# EAGLE design ATM90E26_Featherwing (EAGLE 7.5.0)
CNAME: ATM90E26 ENERGY MINION FEATHERWING; CREVISION: 1.2; DESIGNER: Gokul Shrinivas
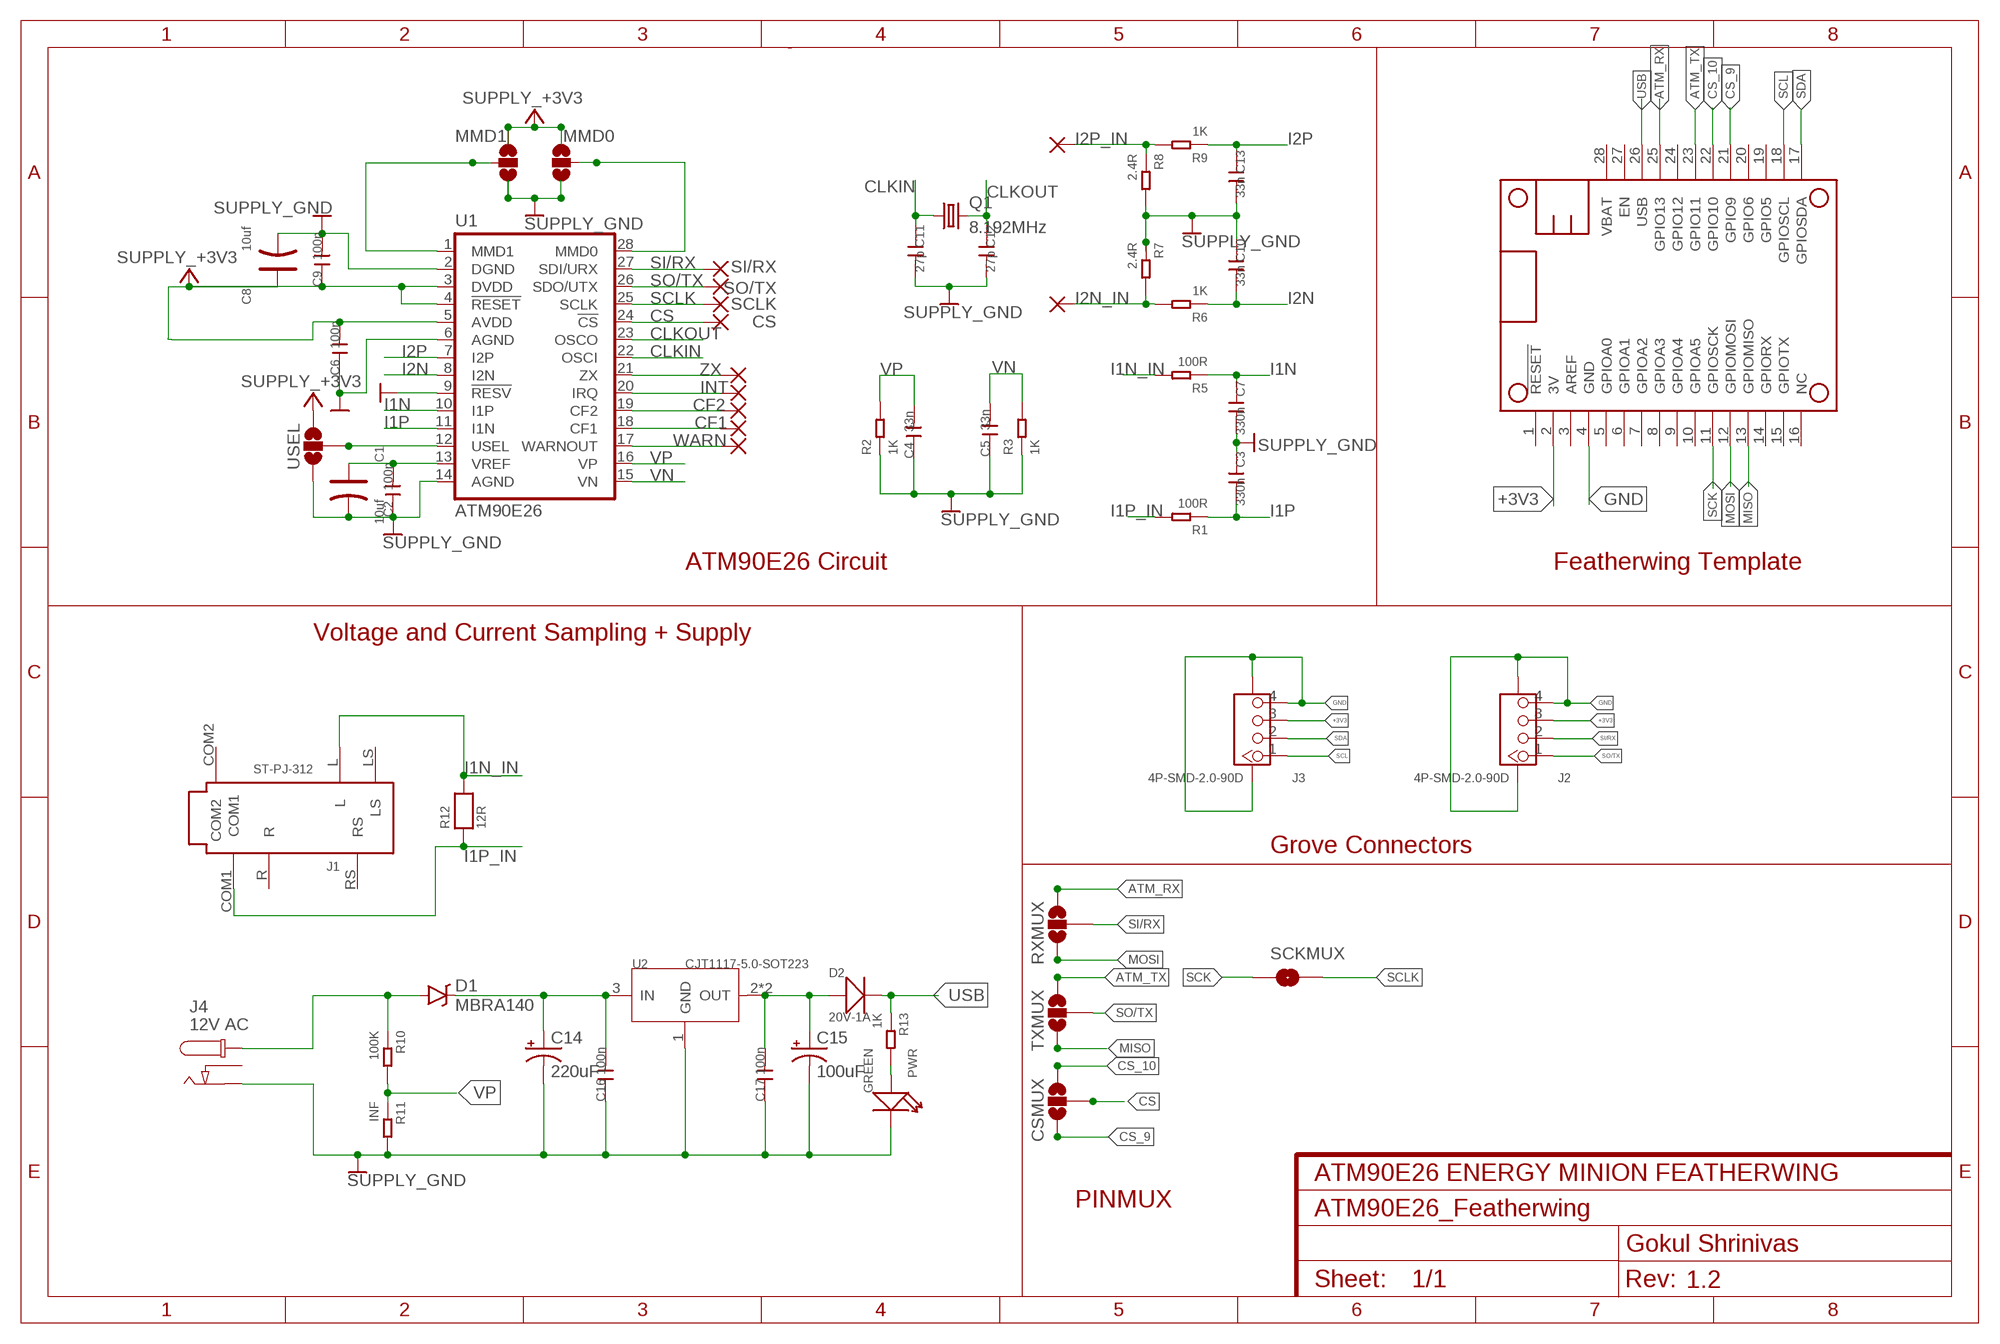
[diagram p0: schematic, sheet 1]

## Parts
C1  10uf  TANTALUM-SMD-22UF-10V(AVX-A)  [AVX-A]
C2  100n  C-0603  [C0603]
C3  330n  C-0603  [C0603]
C4  33n  C-0603  [C0603]
C5  33n  C-0603  [C0603]
C6  100n  C-0603  [C0603]
C7  330n  C-0603  [C0603]
C8  10uf  TANTALUM-SMD-22UF-10V(AVX-A)  [AVX-A]
C9  100n  C-0603  [C0603]
C10  33n  C-0603  [C0603]
C11  27p  C-0603  [C0603]
C12  27p  C-0603  [C0603]
C13  33n  C-0603  [C0603]
C14  220uF  CPOL-US140CLH-1010  [140CLH-1010]
C15  100uF  CPOL-US153CLV-0605  [153CLV-0605]
C16  100n  C-0603  [C0603]
C17  100n  C-0603  [C0603]
CF1  WIREPADSMD1,27-254  [SMD1,27-2,54]
CF2  WIREPADSMD1,27-254  [SMD1,27-2,54]
CS  WIREPADSMD1,27-254  [SMD1,27-2,54]
CSMUX  JUMPER-PAD-3-NOYES_SILK  [PAD-JUMPER-3-NO_YES_SILK]
D1  MBRA140  [SMA-DIODE]
D2  20V-1A  SMD-DIODE-SCHOTTKY-20V-1A(SOD-123)  [SOD-123]
I2N_IN  WIREPADSMD1,27-254  [SMD1,27-2,54]
I2P_IN  WIREPADSMD1,27-254  [SMD1,27-2,54]
INT  WIREPADSMD1,27-254  [SMD1,27-2,54]
J1  ST-PJ-312  AUDIO-JACK-6P-SMD(ST-PJ-312)  [AUDIO6P-SMD-3.5-14.0X6.4X5.0MM]
J2  4P-SMD-2.0-90D  GROVE-CONNECTOR-SMD-90D(4+2P-2.0)  [HW4-SMD-2.0-90D]
J3  4P-SMD-2.0-90D  GROVE-CONNECTOR-SMD-90D(4+2P-2.0)  [HW4-SMD-2.0-90D]
J4  12V AC  CON_DC_M-DC_SMD  [DC_BARREL_JACK_SMD_2MM]
MMD0  JUMPER-PAD-3-NOFULL_BOX_SILK  [PAD-JUMPER-3-NO_YES_SILK_FULL_BOX]
MMD1  JUMPER-PAD-3-NOFULL_BOX_SILK  [PAD-JUMPER-3-NO_YES_SILK_FULL_BOX]
MS1  FEATHERWING_NODIM  [FEATHERWING_DIM]
PWR  GREEN  LED'0603'  [LED-0603]
Q1  8.192MHz  CRYSTALHC49UP  [HC49UP]
R1  100R  SMD-RES-1K(0603)  [R0603]
R2  1K  SMD-RES-1K(0603)  [R0603]
R3  1K  SMD-RES-1K(0603)  [R0603]
R5  100R  SMD-RES-1K(0603)  [R0603]
R6  1K  SMD-RES-1K(0603)  [R0603]
R7  2.4R  SMD-RES-1K(0603)  [R0603]
R8  2.4R  SMD-RES-1K(0603)  [R0603]
R9  1K  SMD-RES-1K(0603)  [R0603]
R10  100K  SMD-RES-0R(0603)  [R0603]
R11  INF  SMD-RES-0R(0603)  [R0603]
R12  12R  RESISTOR0805  [0805]
R13  1K  SMD-RES-0R(0603)  [R0603]
RXMUX  JUMPER-PAD-3-NOYES_SILK  [PAD-JUMPER-3-NO_YES_SILK]
SCKMUX  JUMPER-PAD-2-NOYES_SILK  [PAD-JUMPER-2-NO_YES_SILK]
SCLK  WIREPADSMD1,27-254  [SMD1,27-2,54]
SI/RX  WIREPADSMD1,27-254  [SMD1,27-2,54]
SO/TX  WIREPADSMD1,27-254  [SMD1,27-2,54]
TXMUX  JUMPER-PAD-3-NOYES_SILK  [PAD-JUMPER-3-NO_YES_SILK]
U1  ATM90E26  [SSOP-28]
U2  CJT1117-5.0-SOT223  PMIC-CJT1117-5.0(SOT223)  [SOT-223]
USEL  JUMPER-PAD-3-NOFULL_BOX_SILK  [PAD-JUMPER-3-NO_YES_SILK_FULL_BOX]
WARN  WIREPADSMD1,27-254  [SMD1,27-2,54]
ZX  WIREPADSMD1,27-254  [SMD1,27-2,54]

## Nets
+3V3 [pwr]: C6.2 C8.+ C9.1 J2.3 J3.3 MMD0.3 MMD1.1 MS1.2(3V) U1.3(DVDD) U1.4(!RESET) U1.5(AVDD) USEL.3 ; supply symbol labelled SUPPLY_+3V3
ATM_RX: MS1.25(GPIO13) RXMUX.3
ATM_TX: MS1.23(GPIO11) TXMUX.3
CLKIN: C11.1 Q1.1 U1.22(OSCI)
CLKOUT: C12.1 Q1.2 U1.23(OSCO)
CS: CS.1(P) CSMUX.2 U1.24(!CS)
CS_9: CSMUX.1 MS1.21(GPIO9)
CS_10: CSMUX.3 MS1.22(GPIO10)
GND [pwr]: C1.- C2.1 C3.1 C4.1 C5.1 C6.1 C7.2 C8.- C9.2 C10.1 C11.2 C12.2 C13.2 C14.- C15.- C16.1 C17.1 J2.4 J2.SS1 J2.SS2 J3.4 J3.SS1 J3.SS2 J4.P2 MMD0.1 MMD1.3 MS1.4(GND) PWR.- R2.1 R3.1 R7.1 R8.2 R11.2 U1.2(DGND) U1.6(AGND) U1.9(!RESV) U1.14(AGND) U2.1(GND) USEL.1 ; supply symbol labelled SUPPLY_GND
I1N: C7.1 R5.1 U1.10(I1P)
I1N_IN: J1.L R5.2 R12.2
I1P: C3.2 R1.1 U1.11(I1N)
I1P_IN: J1.COM1 R1.2 R12.1
I2N: C10.2 R6.1 U1.8(I2N)
I2N_IN: I2N_IN.1(P) R6.2 R7.2
I2P: C13.1 R9.1 U1.7(I2P)
I2P_IN: I2P_IN.1(P) R8.1 R9.2
MISO: MS1.13(GPIOMISO) TXMUX.1
MOSI: MS1.12(GPIOMOSI) RXMUX.1
N$1: MMD1.2 U1.1(MMD1)
N$2: MMD0.2 U1.28(MMD0)
N$3 [pwr]: D1.A J4.P1@2(P1) R10.1
N$4: C14.+ C16.2 D1.C U2.3(IN)
N$8: PWR.+ R13.2
N$11: CF1.1(P) U1.18(CF1)
N$12: CF2.1(P) U1.19(CF2)
N$15: U1.12(USEL) USEL.2
N$20: U1.21(ZX) ZX.1(P)
N$21: INT.1(P) U1.20(IRQ)
N$22: U1.17(WARNOUT) WARN.1(P)
SCK: MS1.11(GPIOSCK) SCKMUX.1
SCL: J3.1 MS1.18(GPIOSCL)
SCLK: SCKMUX.2 SCLK.1(P) U1.25(SCLK)
SDA: J3.2 MS1.17(GPIOSDA)
SI/RX: J2.2 RXMUX.2 SI/RX.1(P) U1.27(SDI/URX)
SO/TX: J2.1 SO/TX.1(P) TXMUX.2 U1.26(SDO/UTX)
USB [pwr]: D2.- MS1.26(USB) R13.1
V_OUT [pwr]: C15.+ C17.2 D2.+ U2.2(OUT) U2.TER(OUT)
VN: C5.2 R3.2 U1.15(VN)
VP: C4.2 R2.2 R10.2 R11.1 U1.16(VP)
VREF: C1.+ C2.2 U1.13(VREF)
Unconnected: J1.COM2 J1.LS J1.R J1.RS J4.P3 MS1.1(!RESET) MS1.3(AREF) MS1.5(GPIOA0) MS1.6(GPIOA1) MS1.7(GPIOA2) MS1.8(GPIOA3) MS1.9(GPIOA4) MS1.10(GPIOA5) MS1.14(GPIORX) MS1.15(GPIOTX) MS1.16(NC) MS1.19(GPIO5) MS1.20(GPIO6) MS1.24(GPIO12) MS1.27(EN) MS1.28(VBAT)

## Notes on the sheet
- ATM90E26 Circuit | Featherwing Template
- Voltage and Current Sampling + Supply
- Grove Connectors
- PINMUX

## Library data of the parts
C1 C8 = Seeed-Capacitor-2016:TANTALUM-SMD-22UF-10V(AVX-A): 302020008; MPN: TAJA226*010#NJ; VALUE: 22uf
C2-C7 C9-C13 C16 C17 = Discrete:C*: Ceramic Capacitors
C14 C15 = adafruit:CPOL-US: POLARIZED CAPACITOR, American symbol
CF1 CF2 CS I2N_IN I2P_IN INT SCLK SI/RX SO/TX WARN ZX = wirepad:WIREPAD: Wire PAD connect wire on PCB
CSMUX MMD0 MMD1 RXMUX TXMUX USEL = SparkFun-Passives:JUMPER-PAD-3-NO
D1 = SparkFun-DiscreteSemi:MBRA140: 40V, 1A Schottky rectifier SMA/DO-214AC package DIO-08053; PROD_ID: DIO-08053
D2 = Seeed-OPL-Diode:SMD-DIODE-SCHOTTKY-20V-1A(SOD-123): 304020034; MPN: B5819W
J1 = Seeed-OPL-Connector:AUDIO-JACK-6P-SMD(ST-PJ-312): 320040007
J2 J3 = Seeed-Connector -2016:GROVE-CONNECTOR-SMD-90D(4+2P-2.0): 320110032
J4 = dp_devices:CON_DC_M: DC power connector
MS1 = adafruit:FEATHERWING
PWR = Discrete-new:LED
Q1 = crystal:CRYSTAL: CRYSTAL; OC_FARNELL: unknown; OC_NEWARK: unknown
R1 R5 R7 R8 = Seeed-Resistor-2016:SMD-RES-1K(0603): 301010298; MPN: RC0603FR-071KL; VALUE: 1K
R2 R3 R6 R9 = Seeed-Resistor-2016:SMD-RES-1K(0603): 301010298; MPN: RC0603FR-071KL
R10 R11 R13 = Seeed-Resistor-2016:SMD-RES-0R(0603): 301010292; MPN: RC0603JR-070RL; VALUE: 0R
R12 = microbuilder:RESISTOR: Resistors 0402 - 0402 Surface Mount Package 22 Ohm 1% 1/16W [Digikey: 311-22.0LRTR-ND] 33 Ohm 5% 1/16W 1.0K 5% 1/16W 1.5K 5% 1/16W 2.0K 1% 1/16W 10.0K 1% 1/16W [Digikey: 311-10.0KLRTR-ND] 10.0K 5% 1/16W [Digikey: RMCF0402JT10K0TR-ND] 12.1K 1% 1/16W [Digikey: 311-22.0LRTR-ND] 100.0K 5% 1/16W 0603 - 0603 Surface Mount Package 0 Ohm 1/10 Watt 1% Resistor 15 Ohm 1/10 Watt 1% Resistor 33 Ohm 1/10 Watt 1% Resistor 49.9 Ohm 1/10 Watt 1% Resistor 100 Ohm 1/10 Watt 1% Resistor 150 Ohm 1/10 Watt 1% Resistor 240 Ohm 1/10 Watt 1% Resistor 390 Ohm 1/10 Watt 1% Resistor 560 Ohm 1/10 Watt 1% Resistor 680 Ohm 1/10 Watt 1% Resistor 750 Ohm 1/10 Watt 1% Resistor 1.0K Ohm 1/10 Watt 1% Resistor 1.5K Ohm 1/10 Watt 1% Resistor 2.0K Ohm 1/10 Watt 1% Resistor 2.2K Ohm 1/10 Watt 1% Resistor 3.3K Ohm 1/10 Watt 1% Resistor 4.7K Ohm 1/10 Watt 1% Resistor 10.0K Ohm 1/10 Watt 1% Resistor 12.0K Ohm 1/10 Watt 1% Resistor 12.1K Ohm 1/10 Watt 1% Resistor 20.0K Ohm 1/10 Watt 1% Resistor 33.0K Ohm 1/10 Watt 1% Resistor 100.0K Ohm 1/10 Watt 1% Resistor 0805 - 0805 Surface Mount Package 0 Ohm 1/8 Watt 1% Resistor 33 Ohm 1/8 Watt 1% Resistor 100 Ohm 1/8 Watt 1% Resistor 150 Ohm 1/8 Watt 1% Resistor 200 Ohm 1/8 Watt 1% Resistor 240 Ohm 1/8 Watt 1% Resistor 330 Ohm 1/8 Watt 1% Resistor 390 Ohm 1/8 Watt 1% Resistor 470 Ohm 1/8 Watt 1% Resistor 1.0K Ohm 1/8 Watt 1% Resistor 1.5K Ohm 1/8 Watt 1% Resistor 2.0K Ohm 1/8 Watt 1% Resistor 4.7K Ohm 1/8 Watt 1% Resistor 5.1K Ohm 1/8 Watt 1% Resistor 5.6K Ohm 1/8 Watt 1% Resistor 10.0K Ohm 1/8 Watt 1% Resistor 22.0K Ohm 1/8 Watt 1% Resistor 33.0K Ohm 1/8 Watt 1% Resistor 100K Ohm 1/8 Watt 1% Resistor 1206 - 1206 Surface Mount Package 2012 - 2010 Surface Mount Package 0.11 Ohm 1/2 Watt 1% Resistor - Digikey: RHM.11UCT-ND
SCKMUX = SparkFun-Passives:JUMPER-PAD-2-NO
U1 = ATM90E26:ATM90E26: Single-Phase High-Per formance Wide-Span Energy Metering IC; MANF: Atmel; MANF#: 90E26
U2 = Seeed-IC-2016:PMIC-CJT1117-5.0(SOT223): 310030096; MPN: CJT1117-5.0

## Net classes
0 default: width 0.254 mm, drill 0.33 mm, clearance 0.152 mm
1 pwr: width 0.356 mm, drill 0.33 mm, clearance 0.254 mm

## Board
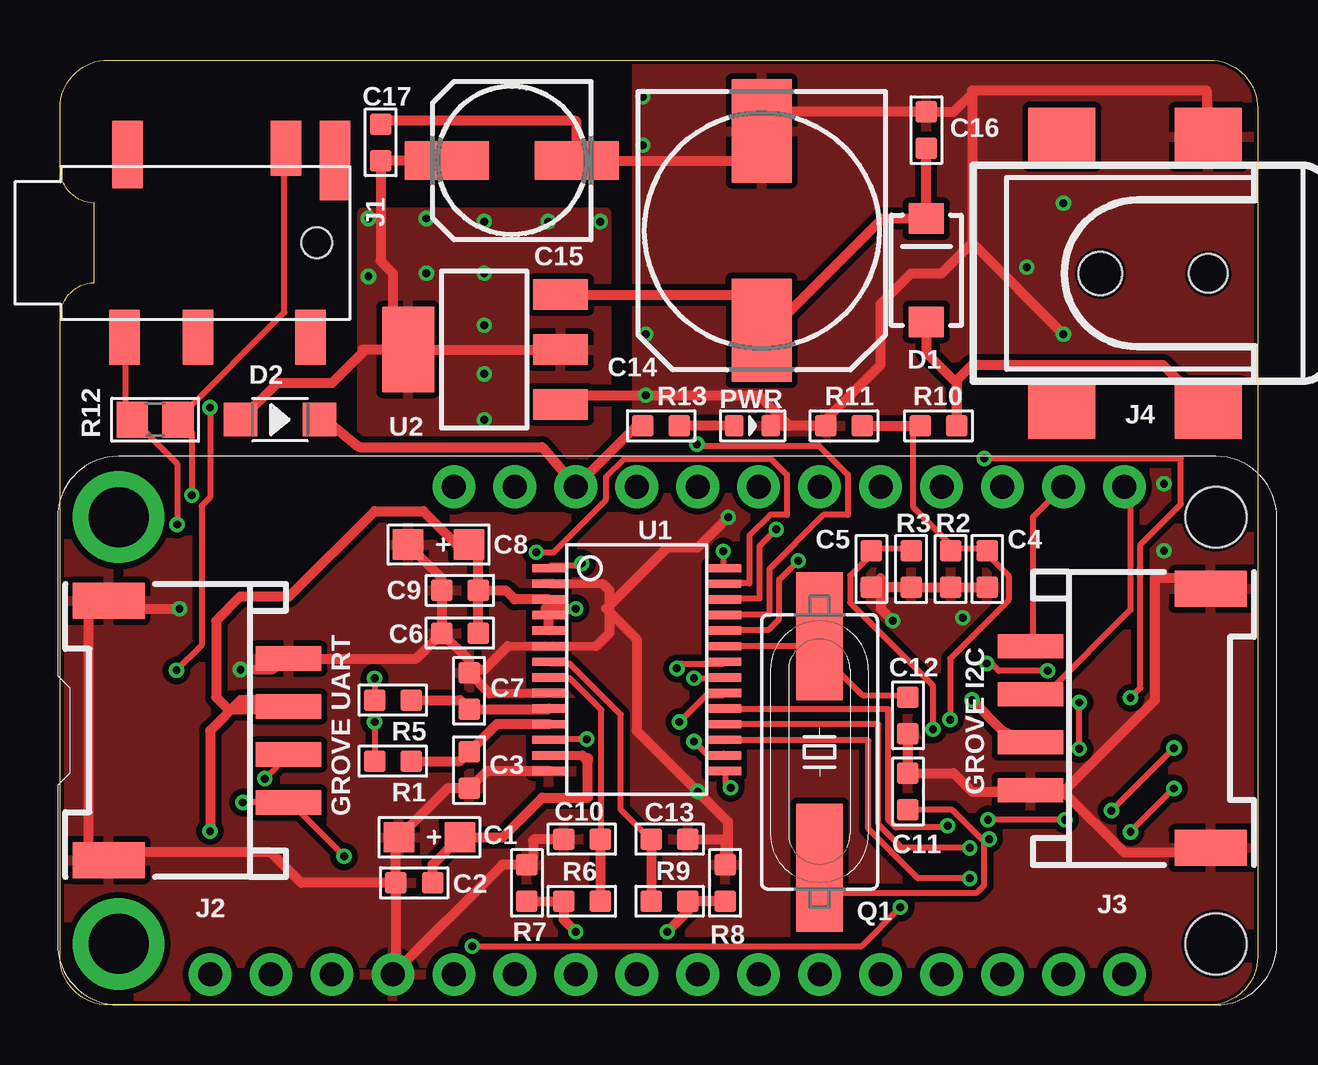
[diagram p1: board, top side]
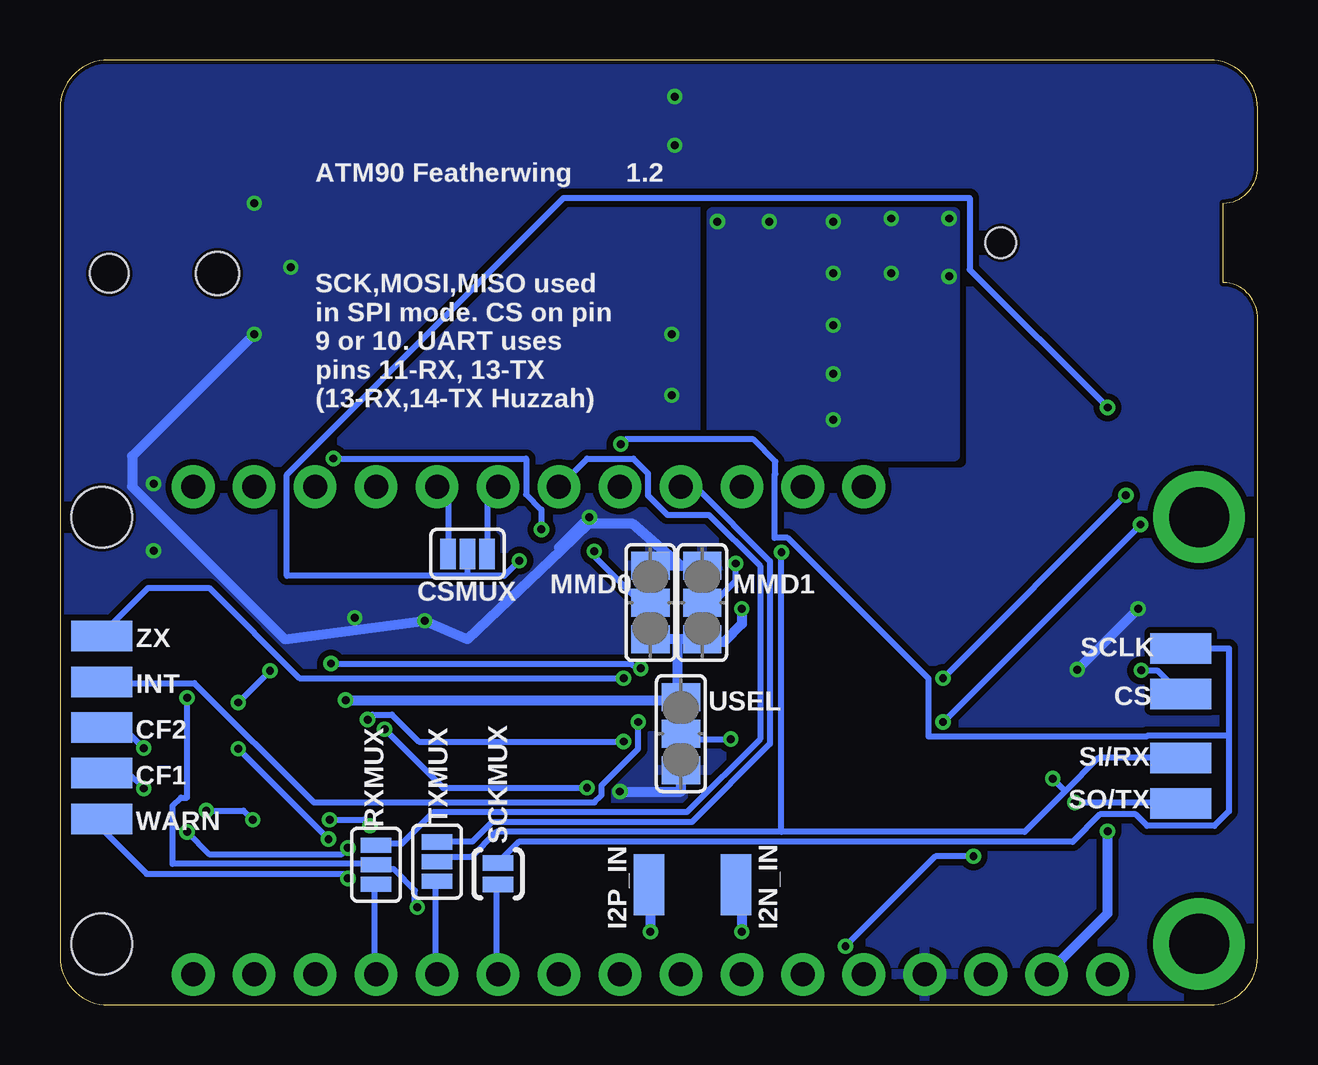
[diagram p2: board, bottom side, seen from below]

Size 49.9 x 39.37 mm. Coordinates in mm from the lower left corner, seen from the top.
Outline: 0,2 0,28.57 arc-90 1.42,30.1 1.42,33.4 arc-90 0,34.92 0,37.37 arc-90 2,39.37 47.9,39.37 arc-90 49.9,37.37 49.9,2 arc-90 47.9,0 2,0 arc-90 0,2
Copper layers (1*16): Top 0.035mm / dielectric 1.5mm / Bottom 0.035mm
Design rules "hackvana": minimum track width 6mil, minimum drill 0.3mm, track to track 6mil, track to pad 6mil, pad to pad 6mil, via to via 6mil, smd to smd 0mil, copper to edge 6mil, drill to drill 6mil, minimum pad ring 10mil, minimum via ring 6mil, stop-mask expansion 2mil, vias tented up to drill 100mil, thermal gap 10mil

### Footprints (pad centres in the part's own frame; a part is rotated, then mirrored left to right if it is on the bottom)
AVX-A = smd 1.27 x 1.27: + -1.27,0; - 1.27,0
C0603 = smd 0.889 x 0.889: 1 -0.762,0; 2 0.762,0
140CLH-1010 = smd 4.3 x 2.5: + 4.15,0; - -4.15,0
153CLV-0605 = smd 3.5 x 1.6: + 2.7,0; - -2.7,0
SMD1,27-2,54 = smd 1.27 x 2.54: 1 0,0
PAD-JUMPER-3-NO_YES_SILK = smd 0.635 x 1.27: 1 -0.813,0; 2 0,0; 3 0.813,0
SMA-DIODE = smd 1.27 x 1.47: A -2.15,0; C 2.15,0
SOD-123 = smd 1.397 x 1.397: + -1.651,0; - 1.651,0
AUDIO6P-SMD-3.5-14.0X6.4X5.0MM = smd 1.27 x 2.286: COM1 -4.572,3.937; L -11.303,-3.937; R -7.62,3.937; RS -12.319,3.937 | smd 1.27 x 2.794: COM2 -4.699,-3.683 | smd 1.27 x 3.302: LS -13.335,-3.429 | hole 1.27: -12.573,0
HW4-SMD-2.0-90D = smd 1.01 x 2.74: 1 -3,-0.1; 2 -1,-0.1; 3 1,-0.1; 4 3,-0.1 | smd 1.5 x 3: SS1 -5.4,7.4; SS2 5.4,7.4
DC_BARREL_JACK_SMD_2MM = smd 2.4 x 2.8: P1@1 -5.7,3.875; P1@2 -5.7,-2.225; P2 5.7,-2.225; P3 5.7,3.875 | hole 1.8: 0,2.275 | hole 1.6: 0,-2.225
PAD-JUMPER-3-NO_YES_SILK_FULL_BOX = smd 1.168 x 1.6: 1 -1.524,0; 2 0,0; 3 1.524,0
FEATHERWING_DIM = drill 1 pad 1.778: 1 6.35,1.27; 2 8.89,1.27; 3 11.43,1.27; 4 13.97,1.27; 5 16.51,1.27; 6 19.05,1.27; 7 21.59,1.27; 8 24.13,1.27; 9 26.67,1.27; 10 29.21,1.27; 11 31.75,1.27; 12 34.29,1.27; 13 36.83,1.27; 14 39.37,1.27; 15 41.91,1.27; 16 44.45,1.27; 17 44.45,21.59; 18 41.91,21.59; 19 39.37,21.59; 20 36.83,21.59; 21 34.29,21.59; 22 31.75,21.59; 23 29.21,21.59; 24 26.67,21.59; 25 24.13,21.59; 26 21.59,21.59; 27 19.05,21.59; 28 16.51,21.59 | drill 2.5 pad 3.81: P$1 2.54,20.32; P$2 2.54,2.54 | hole 2.54: 48.26,20.32; 48.26,2.54
LED-0603 = smd 0.762 x 0.889: + -0.762,0; - 0.762,0
HC49UP = smd 5.334 x 1.93: 1 -4.826,0; 2 4.826,0
R0603 = smd 0.889 x 0.889: 1 0,0.762; 2 0,-0.762
0805 = smd 1.3 x 1.5: 1 -0.95,0; 2 0.95,0
PAD-JUMPER-2-NO_YES_SILK = smd 0.635 x 1.27: 1 -0.45,0; 2 0.45,0
SSOP-28 = smd 0.348 x 1.397: 1 -4.225,-3.656; 2 -3.575,-3.656; 3 -2.925,-3.656; 4 -2.275,-3.656; 5 -1.625,-3.656; 6 -0.975,-3.656; 7 -0.325,-3.656; 8 0.325,-3.656; 9 0.975,-3.656; 10 1.625,-3.656; 11 2.275,-3.656; 12 2.925,-3.656; 13 3.575,-3.656; 14 4.225,-3.656; 15 4.225,3.656; 16 3.575,3.656; 17 2.925,3.656; 18 2.275,3.656; 19 1.625,3.656; 20 0.975,3.656; 21 0.325,3.656; 22 -0.325,3.656; 23 -0.975,3.656; 24 -1.625,3.656; 25 -2.275,3.656; 26 -2.925,3.656; 27 -3.575,3.656; 28 -4.225,3.656
SOT-223 = smd 1.27 x 2.286: 1 -2.286,-3.175; 2 0,-3.175; 3 2.286,-3.175 | smd 3.556 x 2.159: TER 0,3.175

### Placement (x,y rotation side)
C1  15.39,6.99 180 top
C2  14.76,5.08 0 top
C3  17.04,9.78 90 top
C4  38.63,18.16 90 top
C5  33.81,18.16 90 top
C6  16.66,15.49 0 top
C7  17.04,13.08 90 top
C8  15.78,19.18 180 top
C9  16.66,17.27 180 top
C10  21.74,6.91 0 top
C11  35.33,8.89 90 top
C12  35.33,12.06 270 top
C13  25.4,6.91 0 top
C14  29.24,32.26 270 top
C15  18.82,35.18 180 top
C16  36.09,36.45 270 top
C17  13.36,35.94 270 top
CF1  48.16,9.65 270 bottom
CF2  48.16,11.56 270 bottom
CS  3.2,12.95 90 bottom
CSMUX  32.92,18.8 0 bottom
D1  36.09,30.61 90 top
D2  9.17,24.38 0 top
I2N_IN  21.74,5 180 bottom
I2P_IN  25.36,5 180 bottom
INT  48.16,13.46 270 bottom
J1  -1.88,31.75 180 top
J2  9.43,11.43 90 top
J3  40.54,11.94 270 top
J4  45.62,30.48 90 top
MMD0  25.3,16.76 270 bottom
MMD1  23.14,16.76 90 bottom
MS1  -0.1,0 0 top
PWR  28.86,24.13 0 top
Q1  31.65,10.54 90 top
R1  13.87,10.16 270 top
R2  37.11,18.16 180 top
R3  35.46,18.16 180 top
R5  13.87,12.7 270 top
R6  21.74,4.32 270 top
R7  19.46,5.08 0 top
R8  27.71,5.08 180 top
R9  25.4,4.32 90 top
R10  36.6,24.13 270 top
R11  32.67,24.13 270 top
R12  3.96,24.38 0 top
R13  25.05,24.13 90 top
RXMUX  34.19,5.97 90 bottom
SCKMUX  31.65,5.46 90 bottom
SCLK  3.2,14.86 90 bottom
SI/RX  3.2,10.29 90 bottom
SO/TX  3.2,8.38 90 bottom
TXMUX  36.73,5.84 90 bottom
U1  24.03,13.97 270 top
U2  17.68,27.3 90 top
USEL  24.03,11.3 90 bottom
WARN  48.16,7.75 270 bottom
ZX  48.16,15.37 270 bottom

### Tracks (layer width: path | path; a pad name or v marks a point on that pad's centre or on a via)
+3V3  (via drill 0.33)
  Top 0.406: C9.1 17.43,18.8 C8.+ 16.54,19.18 15.14,20.57 13.11,20.57 9.55,17.02 7.52,17.02 6.5,16 6.5,12.83 7.01,12.32 9.41,12.32 J2.3 8.79,12.7 7.52,12.7 6.25,11.43 v6.25,7.24 | C9.1 18.57,17.27 18.95,16.89 U1.3 20.37,16.51 | 20.37,16.51 U1.4 U1.5 | v38,12.7 39.27,11.43 J3.3 | 20.37,16.51 v21.49,16.51 | 20.22,16.51 20.37,16.51 | C6.2 C9.1
  Bottom 0.406: 24.28,15.24 MMD1.1 23.01,15.11 22.25,15.11 21.49,15.88 v21.49,16.51 | 24.28,15.24 MMD0.3 | 24.28,15.24 24.16,15.11 24.16,13.34 24.03,13.21 USEL.3 24.03,12.7 v38,12.7 | v6.25,7.24 6.25,3.81 MS1.2
ATM_RX
  Bottom 0.254: RXMUX.3 34.14,6.81 32.72,6.81 31.9,7.62 23.57,7.62 20.32,10.87 20.32,18.49 23.37,21.54 23.98,21.54 MS1.25
ATM_TX
  Bottom 0.254: MS1.23 27.94,22.76 26.01,22.76 25.4,22.15 25.4,21.23 24.59,20.42 22.86,20.42 20.73,18.29 20.73,11.07 23.78,8.03 34.34,8.03 35.66,6.71 36.68,6.71 TXMUX.3
CLKIN  (via drill 0.33)
  Top 0.254: C11.1 37.19,8.13 38.51,6.81 | 38.51,6.81 38.51,4.98 38.2,4.67 32.01,4.67 31.4,5.28 Q1.1 | v25.71,14.02 25.91,14.22 27.64,14.22 U1.22 | v38.61,14.22 38.81,14.22 39.12,13.92 v41.15,13.92 | v42.47,10.67 v42.47,12.6 | v38.71,6.91 38.61,6.81 38.51,6.81
  Bottom 0.254: v25.71,14.02 25.91,14.02 26.11,14.22 v38.61,14.22 | v42.47,12.6 v41.15,13.92 | v38.71,6.91 v42.47,10.67
CLKOUT
  Top 0.254: C12.1 35.26,12.9 33.43,12.9 31.4,14.94 Q1.2 31.29,14.94 27.74,14.94 U1.23
CS  (via drill 0.33)
  Top 0.254: v30.76,18.51 29.97,17.72 29.97,16.07 29.52,15.62 27.71,15.62 U1.24 | v4.85,13.94 5.9,14.99 5.9,20.8 6.25,21.14 v6.25,24.89
  Bottom 0.254: 32.92,17.88 CSMUX.2 | 32.92,17.88 31.4,17.88 v30.76,18.51 | CS.1 4.19,13.94 v4.85,13.94 | v6.25,24.89 12,30.64 12,33.62 28.92,33.62 40.45,22.1 40.45,17.88 32.92,17.88
CS_9
  Bottom 0.254: CSMUX.1 33.73,21.13 MS1.21
CS_10
  Bottom 0.254: CSMUX.3 32.11,21.13 MS1.22
GND  (via drill 0.33)
  Top 0.356: U1.9 17.89,12.99 | 18.65,14.95 U1.6 22.34,14.95 | U1.2 22.61,17.55
  Top 0.406: C13.2 27.66,6.91 27.71,6.86 27.71,6.35 | 27.71,6.35 R8.2 | C10.1 19.76,6.91 19.71,6.86 19.71,6.1 R7.1 18.44,5.84 MS1.4 14,1.4 C2.1 | 27.71,6.35 27.84,6.35 27.84,7.62 v26.57,8.89 24.03,11.43 24.03,15.24 22.76,16.51 | C2.1 14,6.86 C1.- 16.16,9.02 C3.1 17.77,9.74 U1.14 | C8.- 15.9,17.78 C9.2 C6.1 | 29.11,35.56 28.73,35.18 C15.- 21.52,36.8 21.49,36.83 13.49,36.83 C17.1 | 29.11,35.56 29.11,36.83 29.49,37.21 C16.1 37.24,37.21 38.06,38.04 | 38.06,38.04 38.13,38.1 47.78,38.1 47.78,36.25 J4.P2 | 31.65,24.13 30.38,24.13 | 30.38,24.13 PWR.- | C12.2 C11.2 37.24,9.65 38,8.89 39.27,8.89 | U2.1 21.49,25.4 29.11,25.4 30.38,24.13 | 38,31.75 36.73,30.48 35.46,30.48 34.19,29.21 34.19,26.67 31.65,24.13 | 31.65,24.13 R11.2 | 38,31.75 38,38.1 38.06,38.04 | 29.11,35.56 C14.- | v34.7,16 34.19,16.51 34.19,17.78 C5.1 R3.1 R2.1 C4.1 | 38,31.75 v41.81,27.94 | v7.52,13.97 8.79,13.97 J2.4 14.84,14.43 C6.1 | v4.98,16.51 2.44,16.51 J2.SS2 1.17,16.51 1.17,6.35 J2.SS1 2.44,6.35 8.79,6.35 10.06,5.08 C2.1 | 41.81,8.89 44.35,6.35 46.89,6.35 J3.SS2 | 41.81,8.89 40.54,8.89 J3.4 | 41.81,8.89 45.62,12.7 45.62,17.78 46.89,17.78 J3.SS1 | C7.2 17.04,14.35 C6.1 | 17.89,12.99 C7.2 | 18.65,14.95 17.68,13.97 17.17,13.97 C7.2 | 22.61,17.55 22.89,17.27 22.89,16.51 | 22.89,16.51 22.89,15.49 22.34,14.95 | 22.76,16.51 25.3,19.05 26.57,19.05 v27.84,20.32 | 22.76,16.51 22.89,16.51
  Bottom 0.406: MMD1.3 24.03,18.29 | 24.03,18.29 MMD0.1 | 24.03,10.16 USEL.1 24.03,8.89 v26.57,8.89 | v41.81,27.94 46.89,22.86 46.89,21.59 40.54,15.24 v34.7,16 32.92,15.24 29.01,18.95 | 29.01,18.95 27.84,20.07 26.06,20.07 24.03,18.29 | v7.52,13.97 v4.98,16.51 | v27.84,20.32 29.11,19.05 29.01,18.95
  other vias: 41.81,33.4 40.29,30.73 46,21.72 46,18.92 37.62,16.13 24.41,25.4 24.41,27.94 24.28,37.85 24.28,35.81
  pour Bottom (rank 2): 0,39.37 49.9,39.37 49.9,0 0,0
  pour Top: 0,0 49.9,0 49.9,39.37 24.03,39.37 24.03,20.32 0,20.32
I1N
  Top 0.406: R5.1 16.66,12.7 C7.1 20.35,12.32 U1.10
I1N_IN  (via drill 0.33)
  Top 0.254: v13.11,13.61 R5.2 | v5.49,21.23 5.49,23.88 4.98,24.38 R12.2 4.98,24.49 9.35,28.85 9.35,35.66 J1.L
  Bottom 0.254: v5.49,21.23 v13.11,13.61
I1P
  Top 0.406: R1.1 16.66,10.16 C3.2 18.2,11.7 U1.11
I1P_IN  (via drill 0.33)
  Top 0.254: v13.11,11.79 R1.2 | v4.88,20.02 4.88,22.55 3.05,24.38 R12.1 2.95,24.49 2.75,24.69 2.75,27.74 J1.COM1
  Bottom 0.254: v4.88,20.02 v13.11,11.79
I2N
  Top 0.254: U1.8 20.42,13.61 21.24,13.61 22.56,12.29 22.56,7.01 C10.2
  Top 0.406: C10.2 R6.1
I2N_IN  (via drill 0.33)
  Top 0.406: R7.2 R6.2 20.98,3.56 v21.49,3.05
  Bottom 0.406: v21.49,3.05 21.49,3.81 I2N_IN.1
I2P
  Top 0.254: U1.7 20.42,14.22 21.24,14.22 23.37,12.09 23.37,8.13 24.49,7.01 C13.1
  Top 0.406: C13.1 R9.1
I2P_IN  (via drill 0.33)
  Top 0.406: R8.1 R9.2 26.16,3.91 v25.3,3.05
  Bottom 0.406: v25.3,3.05 25.3,3.81 I2P_IN.1
MISO
  Bottom 0.254: TXMUX.1 36.78,4.98 36.78,1.32 MS1.13
MOSI
  Bottom 0.254: RXMUX.1 34.24,5.08 34.24,1.32 MS1.12
N$1  (via drill 0.33)
  Top 0.254: v21.74,18.39 21.64,18.29 20.42,18.29 U1.1
  Bottom 0.254: v21.74,18.39 21.74,17.68 22.66,16.76 MMD1.2
N$2  (via drill 0.33)
  Top 0.254: v27.64,18.9 27.64,18.29 U1.28
  Bottom 0.254: v27.64,18.9 27.64,18.69 25.71,16.76 MMD0.2
N$3
  Top 0.406: D1.A 36.09,27.18 37.37,25.91 R10.1 37.37,26.04 38,26.67 45.95,26.67 J4.P1@2
N$4
  Top 0.406: C16.2 D1.C 34.27,32.76 29.91,28.41 | 29.91,28.41 C14.+ | U2.3 28.73,29.59 29.91,28.41
N$8
  Top 0.406: PWR.+ R13.2
N$11  (via drill 0.33)
  Top 0.254: v37.91,6.54 35.08,6.54 34.09,7.53 34.09,11.68 27.71,11.68 U1.18 | v46.41,9.02 v44.6,7.21
  Bottom 0.254: v37.91,6.54 38.16,6.29 43.68,6.29 v44.6,7.21 | v46.41,9.02 47.05,9.65 CF1.1
N$12  (via drill 0.33)
  Top 0.254: v36.98,7.46 36.98,7.4 34.82,7.4 34.51,7.71 34.51,12.32 27.71,12.32 U1.19 | v41.87,7.71 v38.67,7.71 | v46.41,10.7 v43.81,8.1
  Bottom 0.254: v36.98,7.46 37.24,7.71 v38.67,7.71 | v41.87,7.71 42.25,8.1 v43.81,8.1 | v46.41,10.7 47.27,11.56 CF2.1
N$15  (via drill 0.33)
  Top 0.254: v21.95,11.07 20.42,11.07 U1.12
  Bottom 0.254: v21.95,11.07 23.78,11.07 23.98,11.28 USEL.2
N$20  (via drill 0.33)
  Top 0.254: v26.42,13.61 27.64,13.61 U1.21
  Bottom 0.254: v26.42,13.61 39.93,13.61 43.69,17.37 46.23,17.37 48.16,15.44 ZX.1
N$21  (via drill 0.33)
  Top 0.254: v25.81,11.79 26.93,12.9 27.64,12.9 U1.20
  Bottom 0.254: v25.81,11.79 25.81,10.67 27.33,9.14 27.33,8.74 27.64,8.43 39.32,8.43 44.3,13.41 48.16,13.41 INT.1
N$22  (via drill 0.33)
  Top 0.254: v37.91,5.27 35.75,5.27 33.68,7.33 33.68,11.02 27.71,11.02 U1.17
  Bottom 0.254: v37.91,5.27 38.09,5.46 46.29,5.46 48.16,7.33 WARN.1
SCK
  Bottom 0.254: SCKMUX.1 31.7,4.98 31.7,1.32 MS1.11
SCL
  Top 0.254: MS1.18 40.54,20.32 40.54,15.04 J3.1
SCLK  (via drill 0.33)
  Top 0.254: v26.54,23.37 26.54,23.3 31.62,23.3 32.82,22.1 32.82,20.41 31.81,20.41 29.55,18.16 29.55,16.26 27.71,16.26 U1.25
  Bottom 0.254: 1.2,11.21 1.2,14.86 SCLK.1 | 1.2,11.21 1.2,8.06 1.8,7.46 4.6,7.46 5.08,7.94 6.57,7.94 7.71,6.79 30.79,6.79 31.65,5.94 SCKMUX.2 | v26.54,23.37 26.35,23.56 21.01,23.56 20.09,22.64 20.09,22.13 20.12,22.1 20.12,19.46 19.58,19.46 13.71,13.59 13.71,11.18 4.63,11.18 4.6,11.21 1.2,11.21
SDA
  Top 0.254: MS1.17 44.6,21.34 44.6,16.46 41.15,13.01 40.54,13.01 J3.2
SI/RX  (via drill 0.33)
  Top 0.254: v19.84,18.86 20.57,18.86 22.76,21.05 22.76,22 23.52,22.77 29.62,22.77 30.29,22.1 30.29,20.41 29.59,20.41 28.73,19.56 28.73,17.56 27.71,17.56 U1.27 | v8.54,9.43 9.52,10.41 J2.2
  Bottom 0.254: RXMUX.2 34,6.16 32.76,6.16 31.71,7.21 19.84,7.21 | 19.84,7.21 9.71,7.21 8.01,8.91 | 8.01,8.91 6.63,10.29 SI/RX.1 | 19.84,7.21 v19.84,18.86 | 8.01,8.91 v8.54,9.43
SO/TX  (via drill 0.33)
  Top 0.254: v7.62,8.43 9.45,8.43 J2.1 9.65,8.38 v11.84,6.19 | v35.02,4.06 33.4,2.44 v17.17,2.44 | v29.84,19.81 29.14,19.11 29.14,16.92 27.71,16.92 U1.26 | v38.51,22.77 46.7,22.77 46.7,20.86 45.02,19.18 45.02,13.21 v44.6,12.79
  Bottom 0.254: v7.62,8.43 3.25,8.43 SO/TX.1 | v35.02,4.06 35.11,4.06 35.11,4.76 36,5.65 36.54,5.65 TXMUX.2 36.82,5.87 45.21,5.87 45.21,8.29 44.86,8.64 44.6,8.64 v44.6,12.79 | v17.17,2.44 13.43,6.19 v11.84,6.19 | v29.84,19.81 29.84,20.64 30.47,21.27 30.47,22.77 v38.51,22.77
USB
  Top 0.406: R13.1 24.03,24.13 MS1.26 20.09,23.24 12.47,23.24 11.08,24.38 D2.-
V_OUT  (via drill 0.33)
  Top 0.406: 13.87,27.3 U2.TER U2.2 | 13.87,27.3 12.6,27.3 12.6,27.18 11.33,25.91 9.04,25.91 D2.+ | C15.+ C17.2 13.36,30.99 13.87,30.48 13.87,27.3
  other vias: 17.68,28.32 17.68,26.29 17.68,30.48 17.68,32.64 15.27,30.48 15.27,32.77 12.85,32.77 12.85,30.35 20.35,32.64 22.51,32.64 17.68,24.38
  pour Top: 12.6,33.02 22.76,33.02 22.76,22.86 12.6,22.86
  pour Bottom: 12.6,33.02 22.76,33.02 22.76,22.86 12.6,22.86
VN  (via drill 0.33)
  Top 0.254: R3.2 35.46,19 33.83,19 C5.2 33.83,18.8 32.92,17.88 32.92,16.76 36.37,13.31 v36.37,11.48 | v27.94,9.04 27.74,9.25 27.74,9.65 U1.15
  Bottom 0.254: v27.94,9.04 33.94,9.04 v36.37,11.48
VP  (via drill 0.33)
  Top 0.254: v26.42,10.97 26.93,10.46 27.64,10.46 U1.16 | v37.09,11.89 37.09,14.43 39.52,16.87 39.52,17.88 38.61,18.8 C4.2 38.61,19 37.19,19 R2.2 37.19,19.1 35.56,20.73 35.56,23.98 R10.2
  Top 0.406: R11.1 R10.2
  Bottom 0.254: v26.42,10.97 34.95,10.97 36.07,12.09 36.88,12.09 v37.09,11.89
VREF
  Top 0.381: U1.13 21.76,10.39
  Top 0.406: C2.2 15.52,5.84 C1.+ 18.44,6.99 20.09,8.64 22,8.64 22,10.16 | 22,10.16 22,10.29 | 21.76,10.39 22,10.16

### Text on the board
tPlace: GROVE I2C | GROVE UART
bPlace: SCK,MOSI,MISO used / in SPI mode. CS on pin / 9 or 10. UART uses / pins 11-RX, 13-TX / (13-RX,14-TX Huzzah)